# Altium schematic sheet Audio.SchDoc
size A4
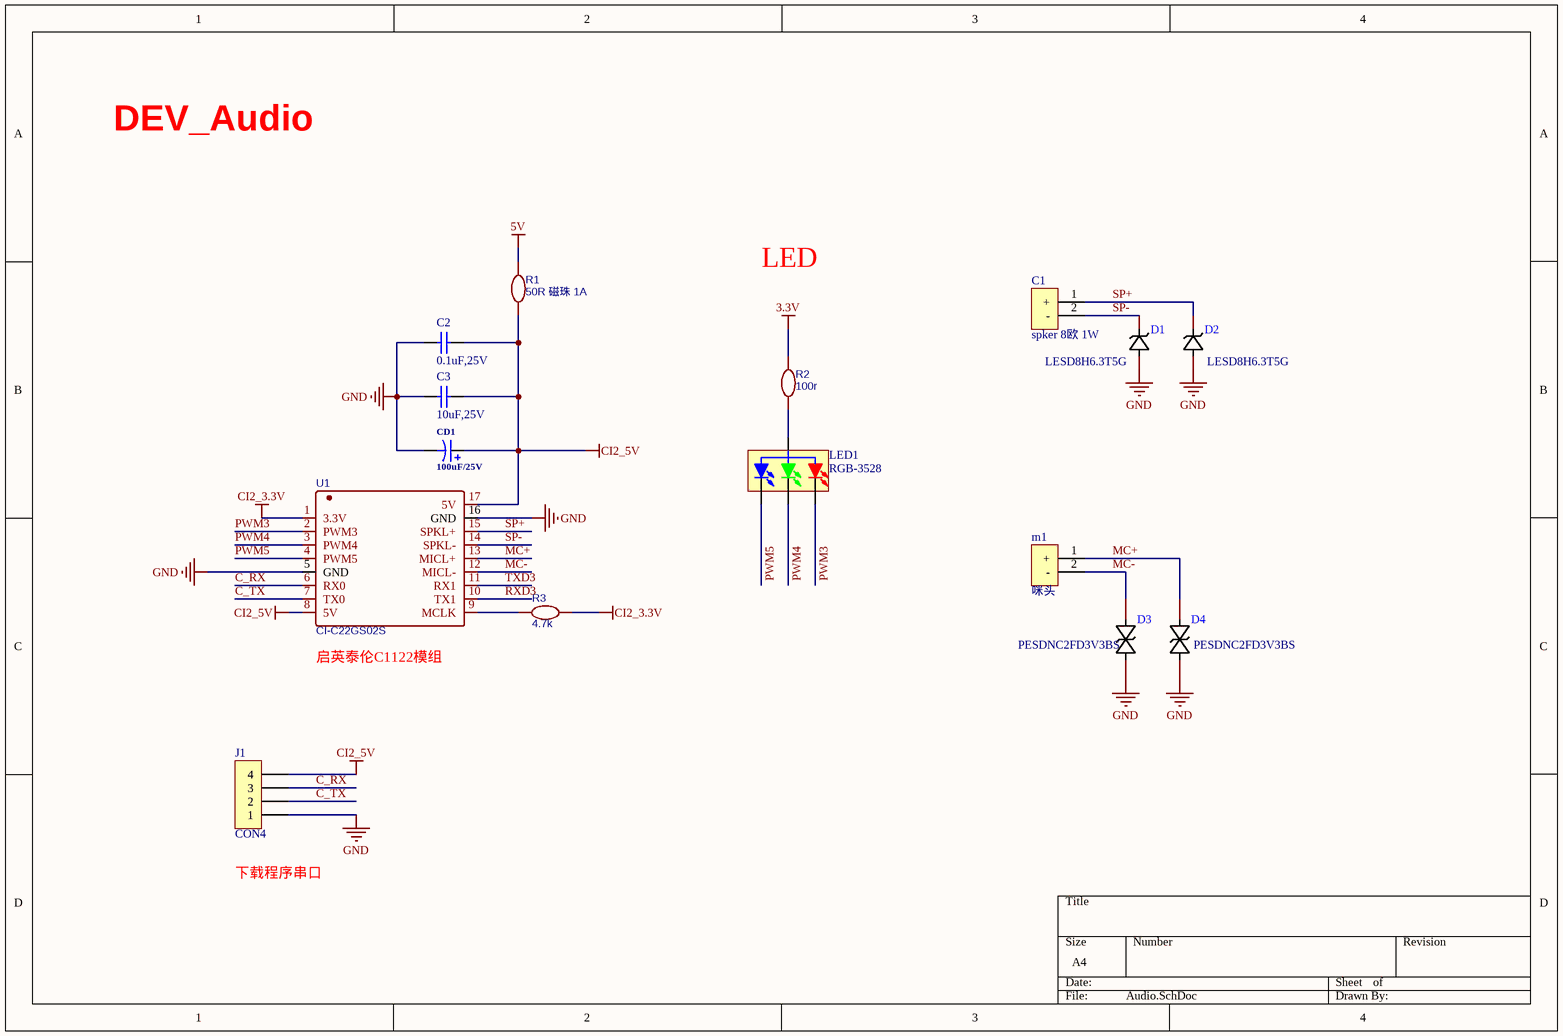
[diagram p0: Audio.SchDoc]

## Parts
C1  spker 8欧 1W  [XH2.54A-2]
C2  value 0.1uF,25V  [0402_C]  (hidden comment: Cap)
C3  value 10uF,25V  [0402_C]  (hidden comment: Cap)
CD1  100uF/25V  [CD7343]
D1  LESD8H6.3T5G  [SOD-882_L1.0-W0.6-R-RD]
D2  LESD8H6.3T5G  [SOD-882_L1.0-W0.6-R-RD]
D3  PESDNC2FD3V3BS  [DFN1006-2L-BI]
D4  PESDNC2FD3V3BS  [DFN1006-2L-BI]
J1  CON4
LED1  RGB-3528  [LED-TH_4P-BD6.9-P1.27-R]
m1  咪头  [MIC-TH_BD6.0-P1.90-D0.4-L-RD]
R1  50R 磁珠 1A  [0402_R]
R2  100r  [0402_R]
R3  4.7k  [0402_R]
U1  CI-C22GS02S  [SMD-17_L20.0-W1.80-CI-C22GS02S]

## Nets
3.3V: R2.2
5V: R1.2
CI2_3.3V: R3.1 U1.1(3.3V)
CI2_5V: C2.1 C3.1 CD1.1 J1.4 R1.1 U1.8(5V) U1.17(5V)
GND: C2.2 C3.2 CD1.2 D1.1(A) D2.1(A) D3.2(K) D4.2(K) J1.1 U1.5(GND) U1.16(GND)
C_RX: J1.3 U1.6(RX0)
C_TX: J1.2 U1.7(TX0)
MC+: D4.1(A) m1.1(+) U1.13(MICL+)
MC-: D3.1(A) m1.2(-) U1.12(MICL-)
PWM3: LED1.1(RED_K) U1.2(PWM3)
PWM4: LED1.3(GREEN_K) U1.3(PWM4)
PWM5: LED1.4(BULE_K) U1.4(PWM5)
RXD3: U1.10(TX1)
SP+: C1.1(+) D2.2(K) U1.15(SPKL+)
SP-: C1.2(-) D1.2(K) U1.14(SPKL-)
TXD3: U1.11(RX1)
NetLED1_2: LED1.2(A) R2.1
NetR3_2: R3.2 U1.9(MCLK)

## Notes on the sheet
- DEV_Audio
- LED
- (near U1) 启英泰伦C1122模组
- (near J1) 下载程序串口

## Library data of the parts
C1 = SPK
C2 C3 = T_Cap_0603_0.1uF_25V_X5R: 贴片电容; Part Typer: X5R; Solder: SMD; Withstand Voltage: 25V; Tolerance: 10%; Schematic Path: X:\Database\Schematic Library.Schlib; Part Number: T_Cap_0603_0.1uF_25V_X5R; LibRef: T_Cap_0603_0.1uF_25V_X5R
CD1 = C-100: 钽电容,Tantalum Capacitors,47uF/16V,3.5*2.8; Published: 8-Jun-2000; LatestRevisionDate: 17-Jul-2002; LatestRevisionNote: Re-released for DXP Platform.; PackageReference: POLAR0.8; Publisher: Altium Limited
D1 D2 = LESD8H6.3T5G: Manufacturer: LRC(乐山无线电); Add into BOM: yes; Polarity: 单向; Reverse Stand-Off Voltage (Vrwm): 6.3V; Breakdown Voltage: 7V; Peak Pulse Current (Ipp)@10/1000μs: 21A@8/20us; Maximum Clamping Voltage: 11V; Name: LESD8H6.3T5G; Symbol: LESD8H6.3T5G; Device: LESD8H6.3T5G; LCSC Part Name: 单向 Vrwm:6.3V; Supplier Part: C383220; Manufacturer Part: LESD8H6.3T5G; Supplier Footprint: SOD-882; JLCPCB Part Class: Extended Part; Datasheet: https://atta.szlcsc.com/upload/public/pdf/source/20200318/C383220_68B8019F200972B4456FCD3E4DB778A0.pdf; Supplier: LCSC; Convert to PCB: yes
D3 D4 = PESDNC2FD3V3BS: Manufacturer: LRC(乐山无线电); Name: LESD8H6.3T5G; Add into BOM: yes; Polarity: 单向; Reverse Stand-Off Voltage (Vrwm): 6.3V; Breakdown Voltage: 7V; Peak Pulse Current (Ipp)@10/1000μs: 21A@8/20us; Maximum Clamping Voltage: 11V; Symbol: LESD8H6.3T5G; Device: LESD8H6.3T5G; LCSC Part Name: 单向 Vrwm:6.3V; Supplier Part: C383220; Manufacturer Part: LESD8H6.3T5G; Supplier Footprint: SOD-882; JLCPCB Part Class: Extended Part; Datasheet: https://atta.szlcsc.com/upload/public/pdf/source/20200318/C383220_68B8019F200972B4456FCD3E4DB778A0.pdf; Supplier: LCSC; Convert to PCB: yes
J1 = CON4: Connector
LED1 = LED-RGB-3528: 三基色LED; 版权归属: 源创客; BOM名称: 三基色LED; 学习资源: www.ooocke.com
m1 = mic
R1-R3 = 100k: nameAlias: Value(Ω); Contributor: LCEDA_Lib; spicePre: R; spiceSymbolName: R_0603_EU
U1 = CI-C22GS02S: BOM_Manufacturer: Chiplntelli(启英泰伦); Contributor: LCSC; BOM_Supplier: LCSC; BOM_Supplier Part: C2759836; BOM_Manufacturer Part: CI-C22GS02S; BOM_JLCPCB Part Class: Extended Part; spicePre: U; spiceSymbolName: CI-C22GS02S